# EAGLE schematic lupa-carrier (EAGLE 9.0.1)

## Sheet 1 of 5: berstak
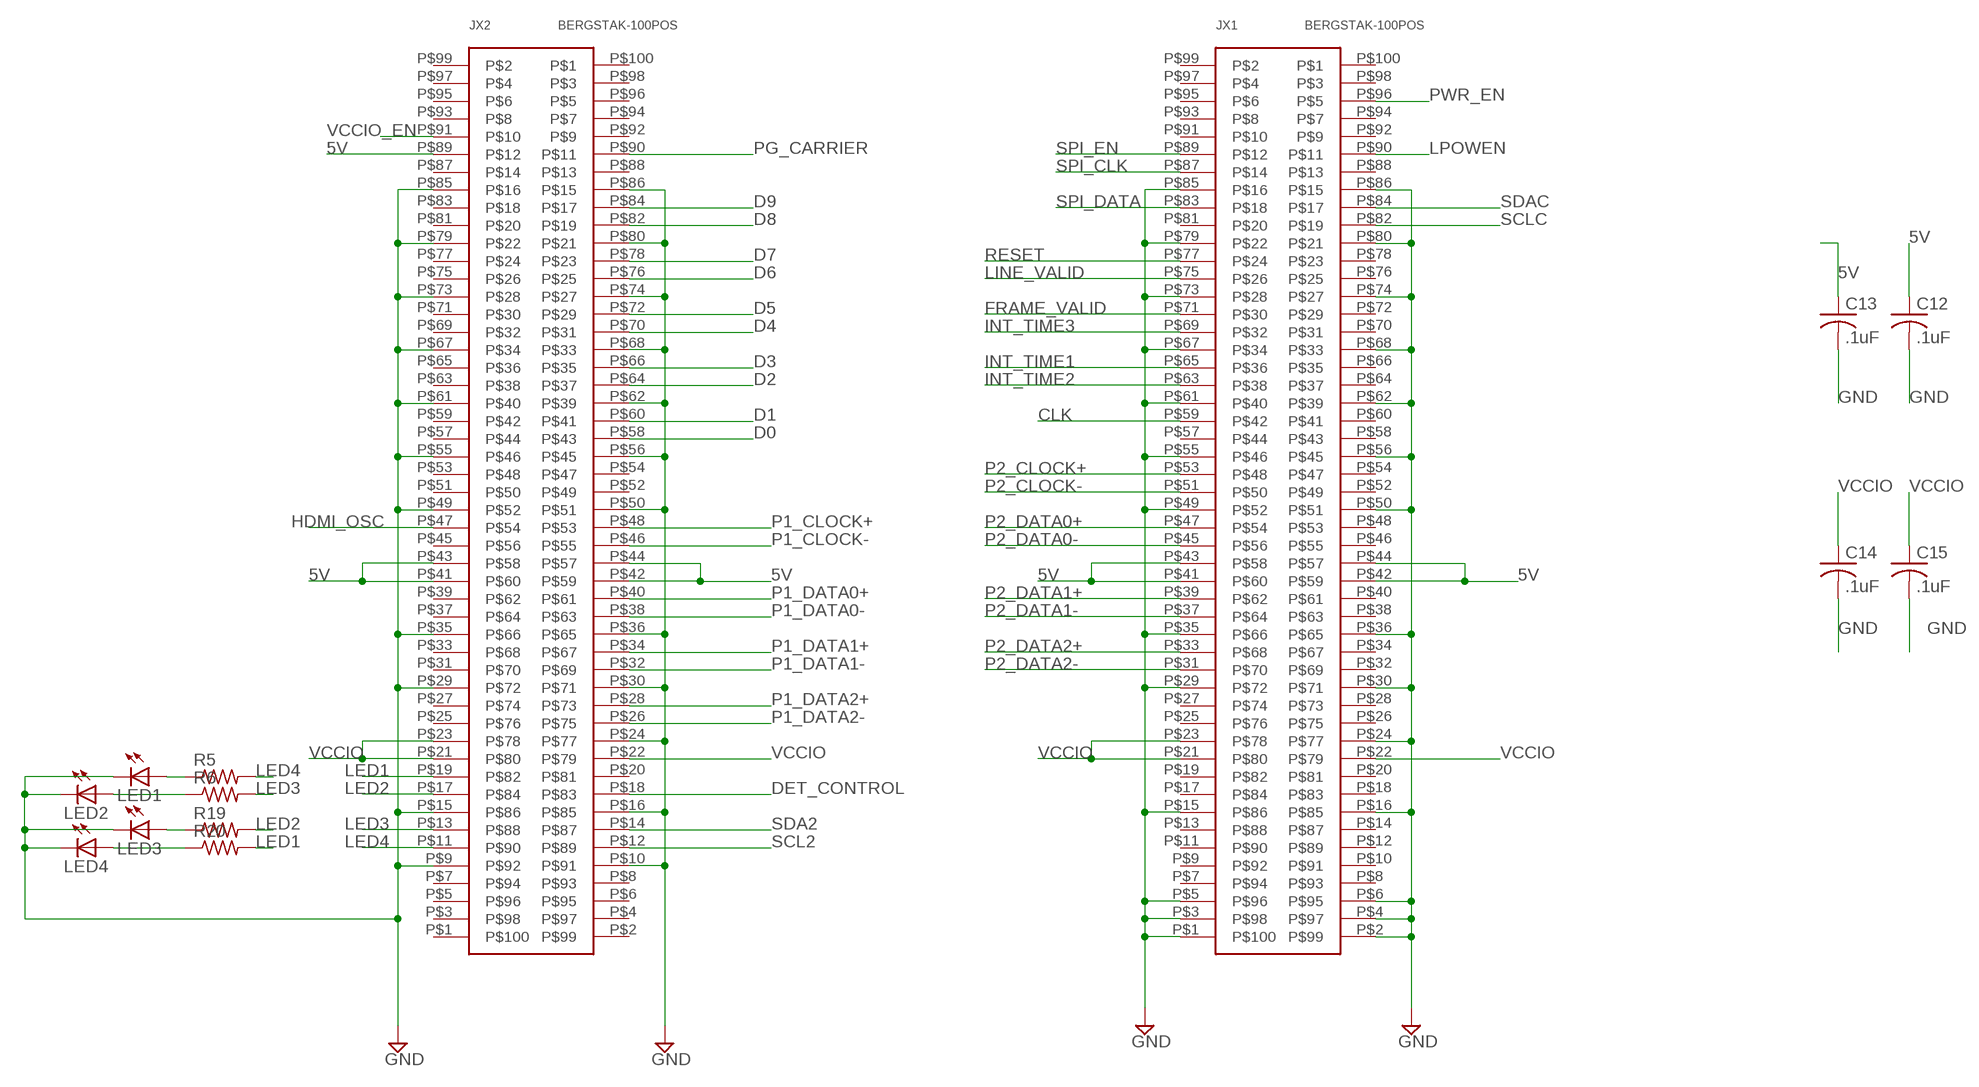
[diagram p0: schematic, sheet 1]

### Parts
C12  .1uF  C-USC0603  [C0603]
C13  .1uF  C-USC0603  [C0603]
C14  .1uF  C-USC0603  [C0603]
C15  .1uF  C-USC0603  [C0603]
JX1  BERGSTAK-100POS  [BERG100POS]
JX2  BERGSTAK-100POS  [BERG100POS]
LED1  LEDCHIPLED_0805  [CHIPLED_0805]
LED2  LEDCHIPLED_0805  [CHIPLED_0805]
LED3  LEDCHIPLED_0805  [CHIPLED_0805]
LED4  LEDCHIPLED_0805  [CHIPLED_0805]
R5  R-US_R0603  [R0603]
R6  R-US_R0603  [R0603]
R19  R-US_R0603  [R0603]
R20  R-US_R0603  [R0603]

### Nets
5V: C12.1 C13.1 JX1.P$41 JX1.P$42 JX1.P$43 JX1.P$44 JX2.P$41 JX2.P$42 JX2.P$43 JX2.P$44 JX2.P$89 ; also sheet 2,4,5
CLK: JX1.P$59 ; also sheet 3
D0: JX2.P$58 ; also sheet 3
D1: JX2.P$60 ; also sheet 3
D2: JX2.P$64 ; also sheet 3
D3: JX2.P$66 ; also sheet 3
D4: JX2.P$70 ; also sheet 3
D5: JX2.P$72 ; also sheet 3
D6: JX2.P$76 ; also sheet 3
D7: JX2.P$78 ; also sheet 3
D8: JX2.P$82 ; also sheet 3
D9: JX2.P$84 ; also sheet 3
DET_CONTROL: JX2.P$18 ; also sheet 5
FRAME_VALID: JX1.P$71 ; also sheet 3
GND: C12.2 C13.2 C14.2 C15.2 JX1.P$1 JX1.P$2 JX1.P$3 JX1.P$4 JX1.P$5 JX1.P$6 JX1.P$15 JX1.P$16 JX1.P$24 JX1.P$29 JX1.P$30 JX1.P$35 JX1.P$36 JX1.P$49 JX1.P$50 JX1.P$55 JX1.P$56 JX1.P$61 JX1.P$62 JX1.P$67 JX1.P$68 JX1.P$73 JX1.P$74 JX1.P$79 JX1.P$80 JX1.P$85 JX1.P$86 JX2.P$9 JX2.P$10 JX2.P$15 JX2.P$16 JX2.P$24 JX2.P$29 JX2.P$30 JX2.P$35 JX2.P$36 JX2.P$49 JX2.P$50 JX2.P$55 JX2.P$56 JX2.P$61 JX2.P$62 JX2.P$67 JX2.P$68 JX2.P$73 JX2.P$74 JX2.P$79 JX2.P$80 JX2.P$85 JX2.P$86 LED1.C LED2.C LED3.C LED4.C ; also sheet 2,3,4,5
HDMI_OSC: JX2.P$47 ; also sheet 5
INT_TIME1: JX1.P$65 ; also sheet 3
INT_TIME2: JX1.P$63 ; also sheet 3
INT_TIME3: JX1.P$69 ; also sheet 3
LED1: JX2.P$19 R20.2
LED2: JX2.P$17 R19.2
LED3: JX2.P$13 R6.2
LED4: JX2.P$11 R5.2
LINE_VALID: JX1.P$75 ; also sheet 3
LPOWEN: JX1.P$90 ; also sheet 4
N$3: LED1.A R5.1
N$13: LED2.A R6.1
N$15: LED3.A R19.1
N$16: LED4.A R20.1
P1_CLOCK+: JX2.P$48 ; also sheet 5
P1_CLOCK-: JX2.P$46 ; also sheet 5
P1_DATA0+: JX2.P$40 ; also sheet 5
P1_DATA0-: JX2.P$38 ; also sheet 5
P1_DATA1+: JX2.P$34 ; also sheet 5
P1_DATA1-: JX2.P$32 ; also sheet 5
P1_DATA2+: JX2.P$28 ; also sheet 5
P1_DATA2-: JX2.P$26 ; also sheet 5
P2_CLOCK+: JX1.P$53 ; also sheet 5
P2_CLOCK-: JX1.P$51 ; also sheet 5
P2_DATA0+: JX1.P$47 ; also sheet 5
P2_DATA0-: JX1.P$45 ; also sheet 5
P2_DATA1+: JX1.P$39 ; also sheet 5
P2_DATA1-: JX1.P$37 ; also sheet 5
P2_DATA2+: JX1.P$33 ; also sheet 5
P2_DATA2-: JX1.P$31 ; also sheet 5
PG_CARRIER: JX2.P$90
PWR_EN: JX1.P$96 ; also sheet 2
RESET: JX1.P$77 ; also sheet 3
SCL2: JX2.P$12 ; also sheet 5
SCLC: JX1.P$82 ; also sheet 5
SDA2: JX2.P$14 ; also sheet 5
SDAC: JX1.P$84 ; also sheet 5
SPI_CLK: JX1.P$87 ; also sheet 3
SPI_DATA: JX1.P$83 ; also sheet 3
SPI_EN: JX1.P$89 ; also sheet 3
VCCIO: C14.1 C15.1 JX1.P$21 JX1.P$22 JX1.P$23 JX2.P$21 JX2.P$22 JX2.P$23 ; also sheet 2,3,5
VCCIO_EN: JX2.P$91 ; also sheet 2
Unconnected: JX1.P$7 JX1.P$8 JX1.P$9 JX1.P$10 JX1.P$11 JX1.P$12 JX1.P$13 JX1.P$14 JX1.P$17 JX1.P$18 JX1.P$19 JX1.P$20 JX1.P$25 JX1.P$26 JX1.P$27 JX1.P$28 JX1.P$32 JX1.P$34 JX1.P$38 JX1.P$40 JX1.P$46 JX1.P$48 JX1.P$52 JX1.P$54 JX1.P$57 JX1.P$58 JX1.P$60 JX1.P$64 JX1.P$66 JX1.P$70 JX1.P$72 JX1.P$76 JX1.P$78 JX1.P$81 JX1.P$88 JX1.P$91 JX1.P$92 JX1.P$93 JX1.P$94 JX1.P$95 JX1.P$97 JX1.P$98 JX1.P$99 JX1.P$100 JX2.P$1 JX2.P$2 JX2.P$3 JX2.P$4 JX2.P$5 JX2.P$6 JX2.P$7 JX2.P$8 JX2.P$20 JX2.P$25 JX2.P$27 JX2.P$31 JX2.P$33 JX2.P$37 JX2.P$39 JX2.P$45 JX2.P$51 JX2.P$52 JX2.P$53 JX2.P$54 JX2.P$57 JX2.P$59 JX2.P$63 JX2.P$65 JX2.P$69 JX2.P$71 JX2.P$75 JX2.P$77 JX2.P$81 JX2.P$83 JX2.P$87 JX2.P$88 JX2.P$92 JX2.P$93 JX2.P$94 JX2.P$95 JX2.P$96 JX2.P$97 JX2.P$98 JX2.P$99 JX2.P$100

## Sheet 2 of 5: carrier power
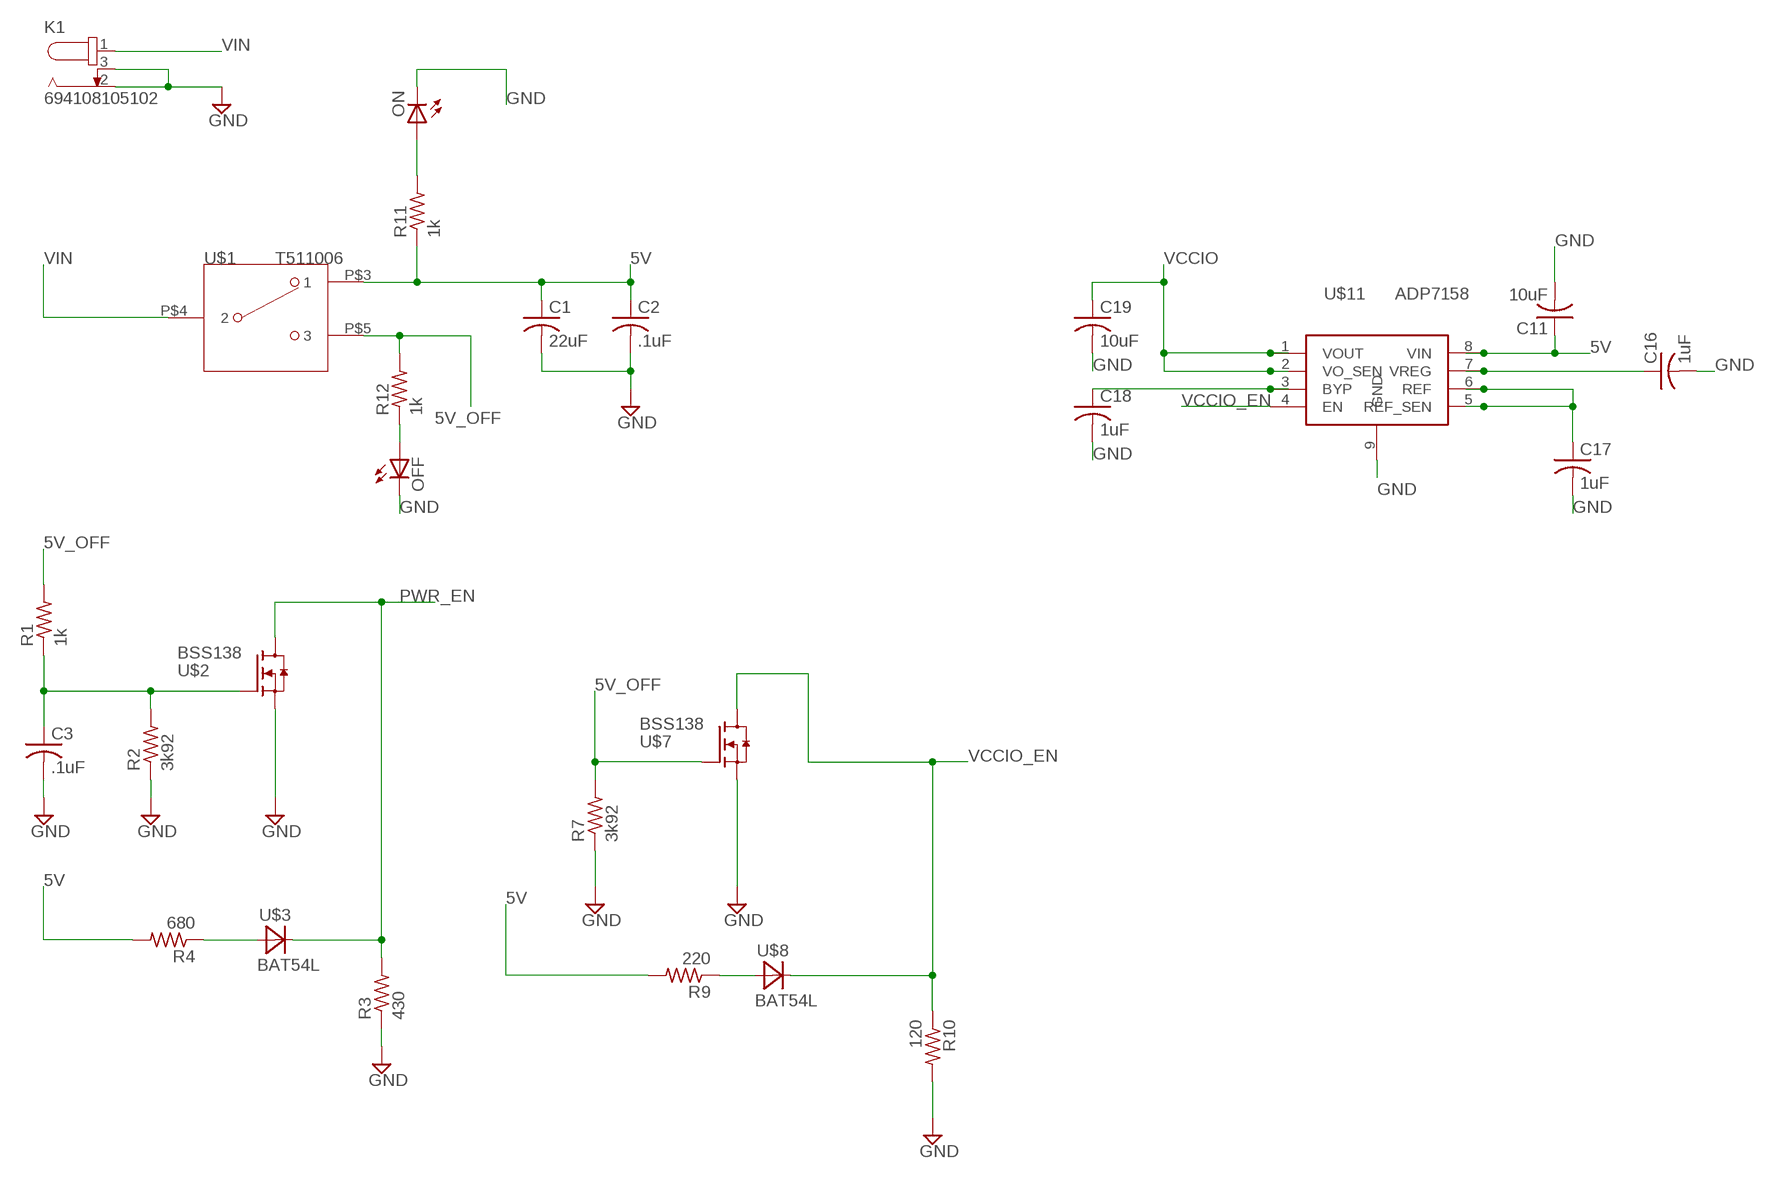
[diagram p1: schematic, sheet 2]

### Parts
C1  22uF  C-USC1206  [C1206]
C2  .1uF  C-USC0603  [C0603]
C3  .1uF  C-USC0603  [C0603]
C11  10uF  C-USC0603  [C0603]
C16  1uF  C-USC0603  [C0603]
C17  1uF  C-USC0603  [C0603]
C18  1uF  C-USC0603  [C0603]
C19  10uF  C-USC0603  [C0603]
K1  694108105102  [694108105102]
OFF  LEDCHIPLED_0805  [CHIPLED_0805]
ON  LEDCHIPLED_0805  [CHIPLED_0805]
R1  1k  R-US_R0603  [R0603]
R2  3k92  R-US_R0603  [R0603]
R3  430  R-US_R0603  [R0603]
R4  680  R-US_R0603  [R0603]
R7  3k92  R-US_R0603  [R0603]
R9  220  R-US_R0603  [R0603]
R10  120  R-US_R0603  [R0603]
R11  1k  R-US_R0603  [R0603]
R12  1k  R-US_R0603  [R0603]
U$1  T511006  [SPDT]
U$2  BSS138  [SOT23]
U$3  BAT54L  [SOT23]
U$7  BSS138  [SOT23]
U$8  BAT54L  [SOT23]
U$11  ADP7158  [SO08]

### Nets
5V: C1.1 C2.1 C11.1 R4.2 R9.2 R11.1 U$1.P$3 U$11.8(VIN) ; also sheet 1,4,5
5V_OFF: R1.2 R7.2 R12.2 U$1.P$5 U$7.1(G)
GND: C1.2 C2.2 C3.2 C11.2 C16.2 C17.2 C18.2 C19.2 K1.2 K1.3 OFF.C ON.C R2.1 R3.1 R7.1 R10.2 U$2.2(S) U$7.2(S) U$11.9(GND) ; also sheet 1,3,4,5
N$1: C3.1 R1.1 R2.2 U$2.1(G)
N$4: R4.1 U$3.1(A)
N$5: ON.A R11.2
N$8: R9.1 U$8.1(A)
N$10: C16.1 U$11.7(VREG)
N$11: C17.1 U$11.5(REF_SEN) U$11.6(REF)
N$12: C18.1 U$11.3(BYP)
N$24: OFF.A R12.1
PWR_EN: R3.2 U$2.3(D) U$3.3(C) ; also sheet 1
VCCIO: C19.1 U$11.1(VOUT) U$11.2(VO_SEN) ; also sheet 1,3,5
VCCIO_EN: R10.1 U$7.3(D) U$8.3(C) U$11.4(EN) ; also sheet 1
VIN: K1.1 U$1.P$4

## Sheet 3 of 5: lupa300
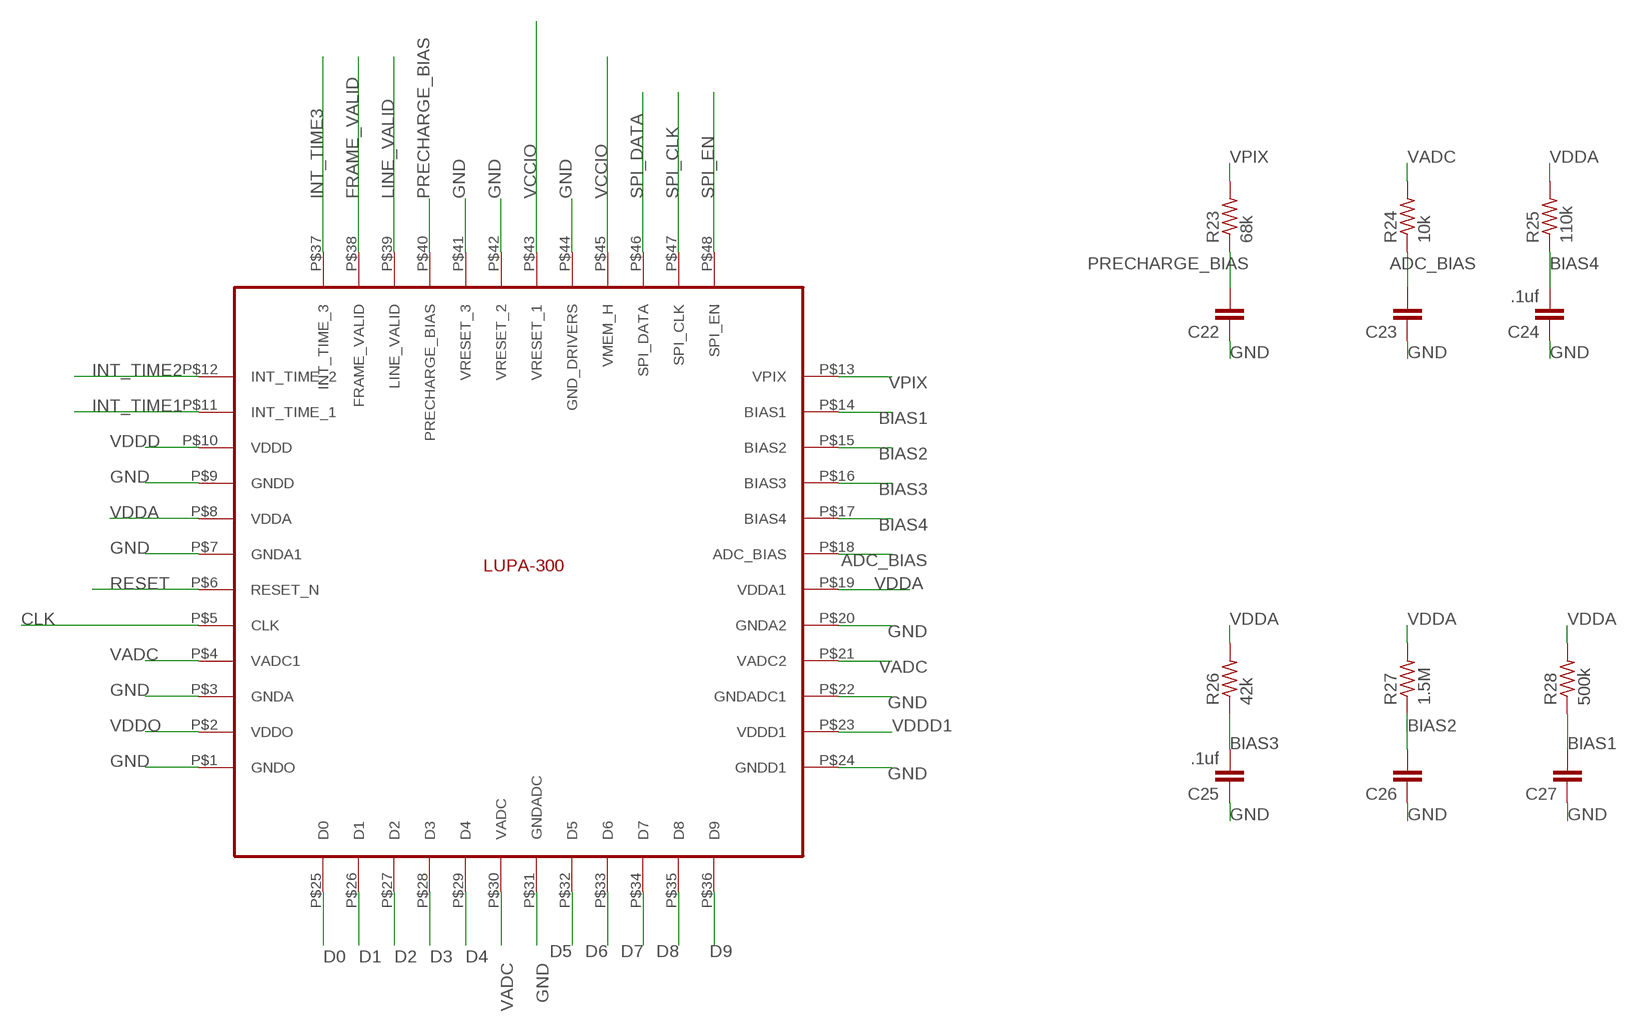
[diagram p2: schematic, sheet 3]

### Parts
C22  C-EUC0603  [C0603]
C23  C-EUC0603  [C0603]
C24  .1uf  C-EUC0603  [C0603]
C25  .1uf  C-EUC0603  [C0603]
C26  C-EUC0603  [C0603]
C27  C-EUC0603  [C0603]
R23  68k  R-US_R0603  [R0603]
R24  10k  R-US_R0603  [R0603]
R25  110k  R-US_R0603  [R0603]
R26  42k  R-US_R0603  [R0603]
R27  1.5M  R-US_R0603  [R0603]
R28  500k  R-US_R0603  [R0603]
U$4  LUPA300  [LUPA300]

### Nets
ADC_BIAS: C23.2 R24.1 U$4.P$18(ADC_BIAS)
BIAS1: C27.2 R28.1 U$4.P$14(BIAS1)
BIAS2: C26.2 R27.1 U$4.P$15(BIAS2)
BIAS3: C25.2 R26.1 U$4.P$16(BIAS3)
BIAS4: C24.2 R25.1 U$4.P$17(BIAS4)
CLK: U$4.P$5(CLK) ; also sheet 1
D0: U$4.P$25(D0) ; also sheet 1
D1: U$4.P$26(D1) ; also sheet 1
D2: U$4.P$27(D2) ; also sheet 1
D3: U$4.P$28(D3) ; also sheet 1
D4: U$4.P$29(D4) ; also sheet 1
D5: U$4.P$32(D5) ; also sheet 1
D6: U$4.P$33(D6) ; also sheet 1
D7: U$4.P$34(D7) ; also sheet 1
D8: U$4.P$35(D8) ; also sheet 1
D9: U$4.P$36(D9) ; also sheet 1
FRAME_VALID: U$4.P$38(FRAME_VALID) ; also sheet 1
GND: C22.1 C23.1 C24.1 C25.1 C26.1 C27.1 U$4.P$1(GNDO) U$4.P$3(GNDA) U$4.P$7(GNDA1) U$4.P$9(GNDD) U$4.P$20(GNDA2) U$4.P$22(GNDADC1) U$4.P$24(GNDD1) U$4.P$31(GNDADC) U$4.P$41(VRESET_3) U$4.P$42(VRESET_2) U$4.P$44(GND_DRIVERS) ; also sheet 1,2,4,5
INT_TIME1: U$4.P$11(INT_TIME_1) ; also sheet 1
INT_TIME2: U$4.P$12(INT_TIME_2) ; also sheet 1
INT_TIME3: U$4.P$37(INT_TIME_3) ; also sheet 1
LINE_VALID: U$4.P$39(LINE_VALID) ; also sheet 1
PRECHARGE_BIAS: C22.2 R23.1 U$4.P$40(PRECHARGE_BIAS)
RESET: U$4.P$6(RESET_N) ; also sheet 1
SPI_CLK: U$4.P$47(SPI_CLK) ; also sheet 1
SPI_DATA: U$4.P$46(SPI_DATA) ; also sheet 1
SPI_EN: U$4.P$48(SPI_EN) ; also sheet 1
VADC: R24.2 U$4.P$4(VADC1) U$4.P$21(VADC2) U$4.P$30(VADC) ; also sheet 4
VCCIO: U$4.P$43(VRESET_1) U$4.P$45(VMEM_H) ; also sheet 1,2,5
VDDA: R25.2 R26.2 R27.2 R28.2 U$4.P$8(VDDA) U$4.P$19(VDDA1) ; also sheet 4
VDDD: U$4.P$10(VDDD) ; also sheet 4
VDDD1: U$4.P$23(VDDD1) ; also sheet 4
VDDO: U$4.P$2(VDDO) ; also sheet 4
VPIX: R23.2 U$4.P$13(VPIX) ; also sheet 4

## Sheet 4 of 5: lupa power
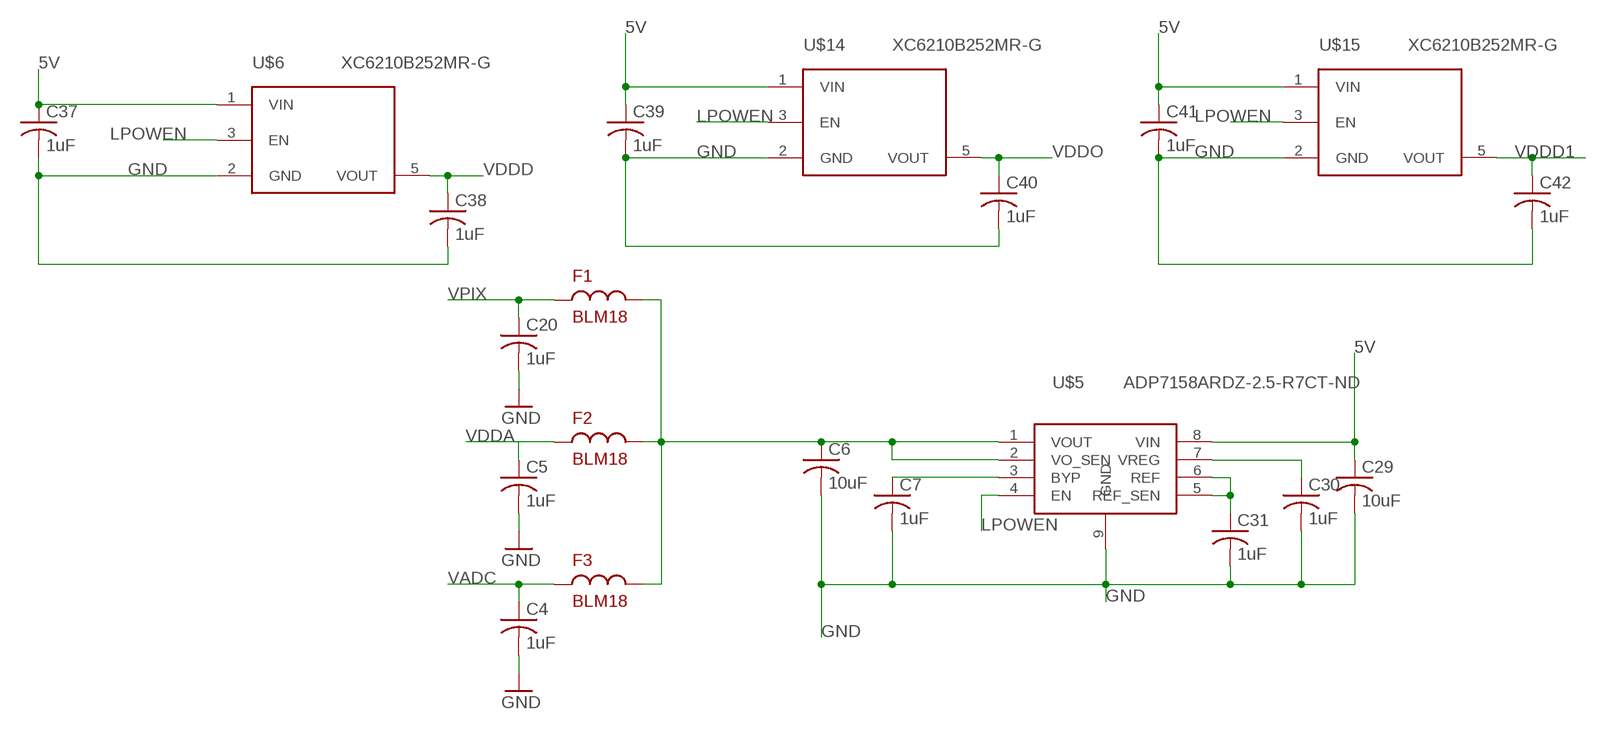
[diagram p3: schematic, sheet 4]

### Parts
C4  1uF  C-USC0603  [C0603]
C5  1uF  C-USC0603  [C0603]
C6  10uF  C-USC0603  [C0603]
C7  1uF  C-USC0603  [C0603]
C20  1uF  C-USC0603  [C0603]
C29  10uF  C-USC0603  [C0603]
C30  1uF  C-USC0603  [C0603]
C31  1uF  C-USC0603  [C0603]
C37  1uF  C-USC0603  [C0603]
C38  1uF  C-USC0603  [C0603]
C39  1uF  C-USC0603  [C0603]
C40  1uF  C-USC0603  [C0603]
C41  1uF  C-USC0603  [C0603]
C42  1uF  C-USC0603  [C0603]
F1  BLM18  [C0603K]
F2  BLM18  [C0603K]
F3  BLM18  [C0603K]
U$5  ADP7158ARDZ-2.5-R7CT-ND  [SO08]
U$6  XC6210B252MR-G  [SOT25]
U$14  XC6210B252MR-G  [SOT25]
U$15  XC6210B252MR-G  [SOT25]

### Nets
5V: C29.1 C37.1 C39.1 C41.1 U$5.8(VIN) U$6.1(VIN) U$14.1(VIN) U$15.1(VIN) ; also sheet 1,2,5
GND: C4.2 C5.2 C6.2 C7.2 C20.2 C29.2 C30.2 C31.2 C37.2 C38.2 C39.2 C40.2 C41.2 C42.2 U$5.9(GND) U$6.2(GND) U$14.2(GND) U$15.2(GND) ; also sheet 1,2,3,5
LPOWEN: U$5.4(EN) U$6.3(EN) U$14.3(EN) U$15.3(EN) ; also sheet 1
N$2: C6.1 F1.2 F2.2 F3.2 U$5.1(VOUT) U$5.2(VO_SEN)
N$14: C7.1 U$5.3(BYP)
N$22: C30.1 U$5.7(VREG)
N$23: C31.1 U$5.5(REF_SEN) U$5.6(REF)
VADC: C4.1 F3.1 ; also sheet 3
VDDA: C5.1 F2.1 ; also sheet 3
VDDD: C38.1 U$6.5(VOUT) ; also sheet 3
VDDD1: C42.1 U$15.5(VOUT) ; also sheet 3
VDDO: C40.1 U$14.5(VOUT) ; also sheet 3
VPIX: C20.1 F1.1 ; also sheet 3

## Sheet 5 of 5: HDMI connectors
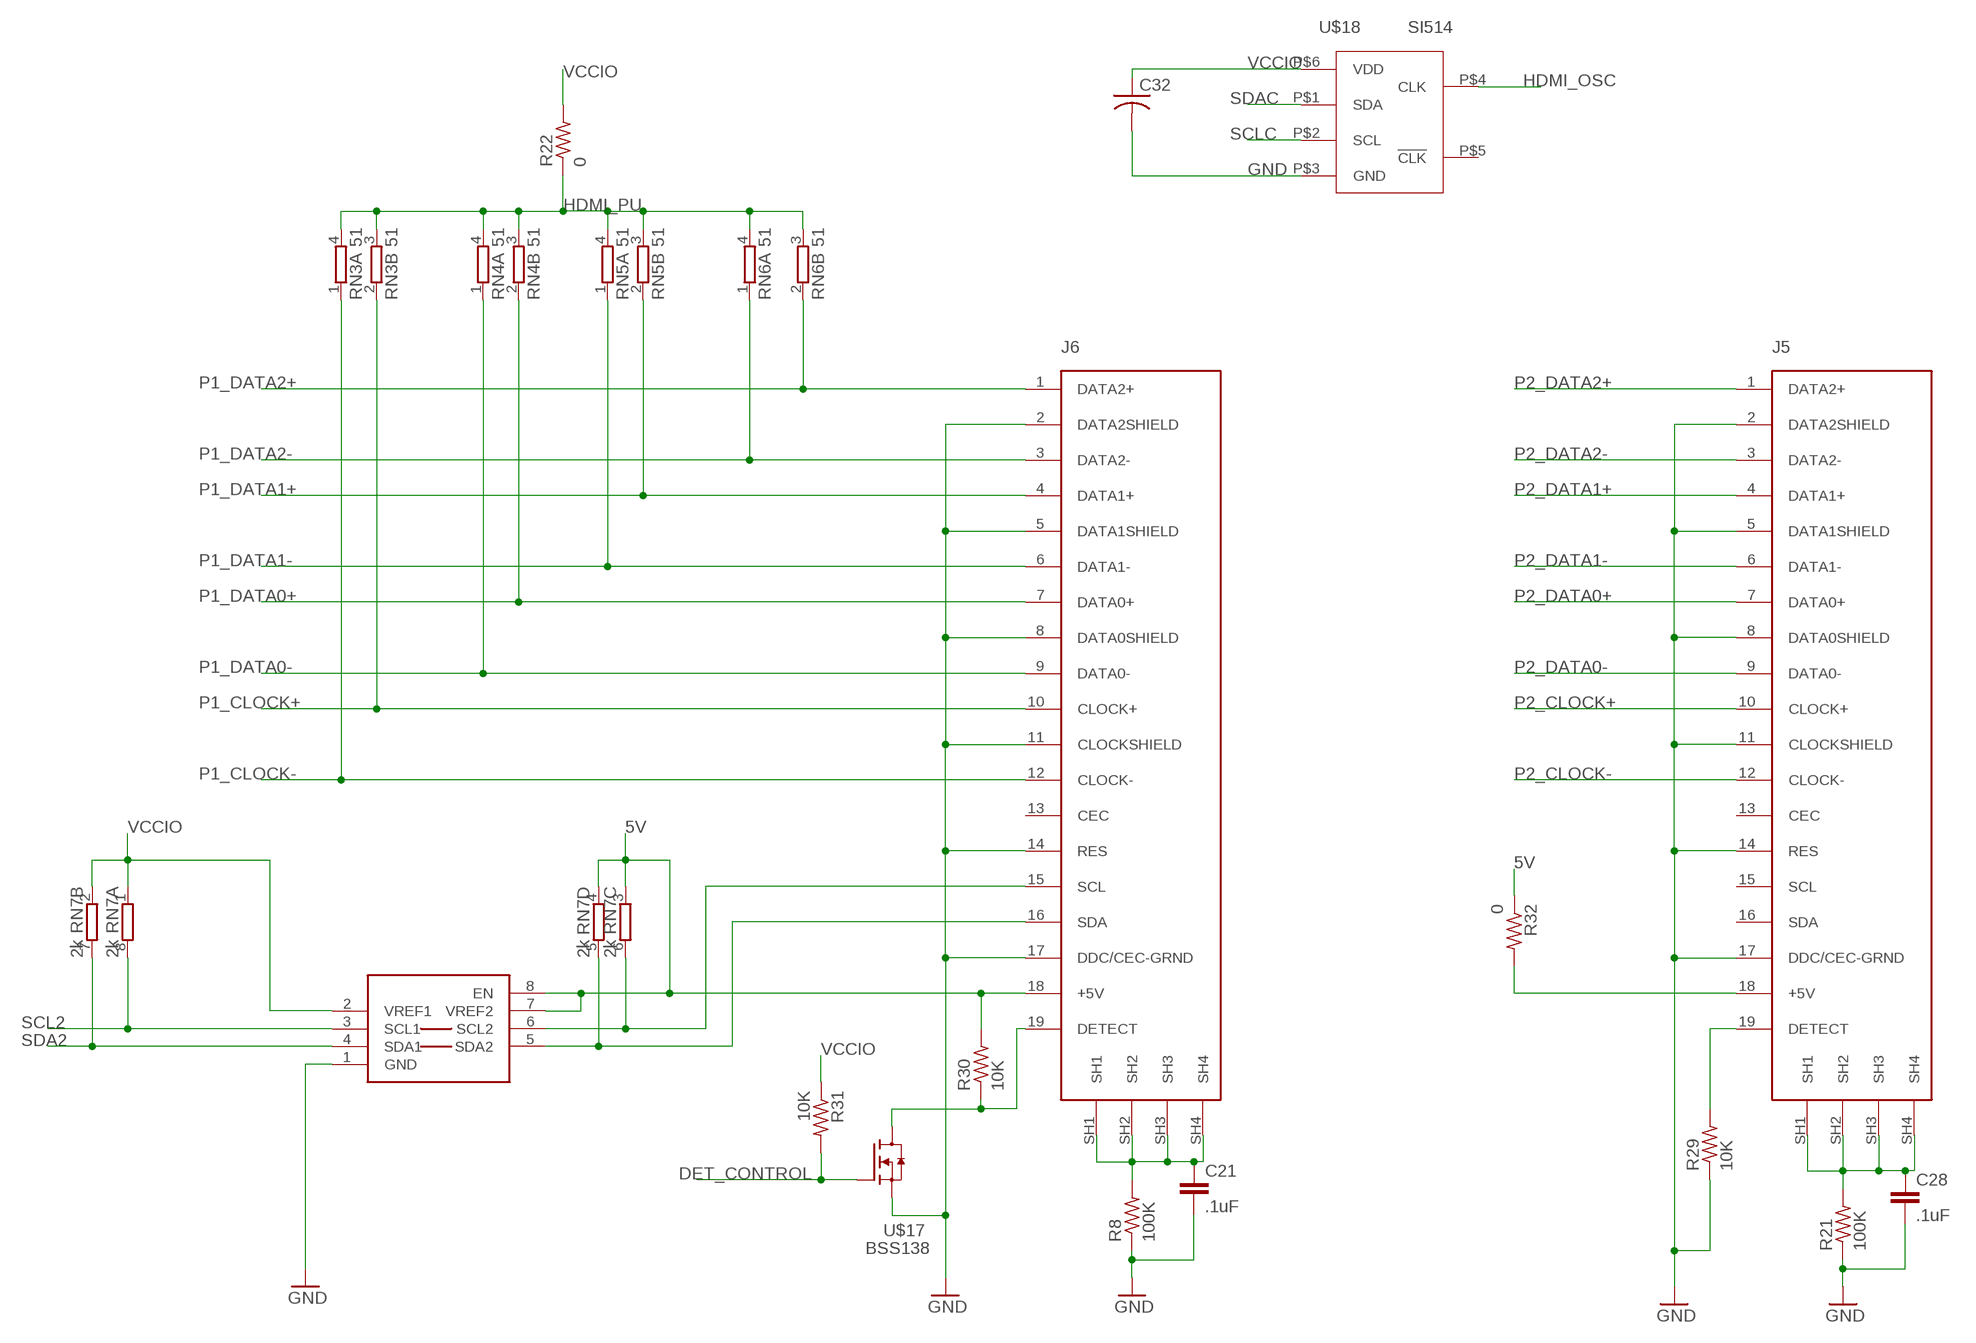
[diagram p4: schematic, sheet 5]

### Parts
C21  .1uF  C-EUC0603K  [C0603K]
C28  .1uF  C-EUC0603K  [C0603K]
C32  C-USC0603  [C0603]
J5  HDMI-TYPE-A-RECEPTICALFCI10029449  [FCI-HDMI-TYPE-A-RECEPT]
J6  HDMI-TYPE-A-RECEPTICALFCI10029449  [FCI-HDMI-TYPE-A-RECEPT]
PCA9306  PCA9306  [PSOP-8]
R8  100K  R-US_R0603  [R0603]
R21  100K  R-US_R0603  [R0603]
R22  0  R-US_R0603  [R0603]
R29  10K  R-US_R0603  [R0603]
R30  10K  R-US_R0603  [R0603]
R31  10K  R-US_R0603  [R0603]
R32  0  R-US_R0603  [R0603]
RN3  51  2R-NEXB34V  [EXB34V]
RN4  51  2R-NEXB34V  [EXB34V]
RN5  51  2R-NEXB34V  [EXB34V]
RN6  51  2R-NEXB34V  [EXB34V]
RN7  2k  4R-N0603-ARV  [0603-ARV]
U$17  BSS138  [SOT23]
U$18  SI514  [XTAL-6PIN]

### Nets
5V: J6.18(+5V) PCA9306.7(VREF2) PCA9306.8(EN) R30.2 R32.1 RN7.3 RN7.4 ; also sheet 1,2,4
DET_CONTROL: R31.2 U$17.1(G) ; also sheet 1
GND: C21.2 C28.2 C32.2 J5.2(DATA2SHIELD) J5.5(DATA1SHIELD) J5.8(DATA0SHIELD) J5.11(CLOCKSHIELD) J5.14(RES) J5.17(DDC/CEC-GRND) J6.2(DATA2SHIELD) J6.5(DATA1SHIELD) J6.8(DATA0SHIELD) J6.11(CLOCKSHIELD) J6.14(RES) J6.17(DDC/CEC-GRND) PCA9306.1(GND) R8.1 R21.1 R29.1 U$17.2(S) U$18.P$3(GND) ; also sheet 1,2,3,4
HDMI_OSC: U$18.P$4(CLK) ; also sheet 1
HDMI_PU: R22.1 RN3.3 RN3.4 RN4.3 RN4.4 RN5.3 RN5.4 RN6.3 RN6.4
N$6: C28.1 J5.SH1 J5.SH2 J5.SH3 J5.SH4 R21.2
N$17: J5.19(DETECT) R29.2
N$18: J6.19(DETECT) R30.1 U$17.3(D)
N$19: J6.16(SDA) PCA9306.5(SDA2) RN7.5
N$20: J6.15(SCL) PCA9306.6(SCL2) RN7.6
N$21: J5.18(+5V) R32.2
N$34: C21.1 J6.SH1 J6.SH2 J6.SH3 J6.SH4 R8.2
P1_CLOCK+: J6.10(CLOCK+) RN3.2 ; also sheet 1
P1_CLOCK-: J6.12(CLOCK-) RN3.1 ; also sheet 1
P1_DATA0+: J6.7(DATA0+) RN4.2 ; also sheet 1
P1_DATA0-: J6.9(DATA0-) RN4.1 ; also sheet 1
P1_DATA1+: J6.4(DATA1+) RN5.2 ; also sheet 1
P1_DATA1-: J6.6(DATA1-) RN5.1 ; also sheet 1
P1_DATA2+: J6.1(DATA2+) RN6.2 ; also sheet 1
P1_DATA2-: J6.3(DATA2-) RN6.1 ; also sheet 1
P2_CLOCK+: J5.10(CLOCK+) ; also sheet 1
P2_CLOCK-: J5.12(CLOCK-) ; also sheet 1
P2_DATA0+: J5.7(DATA0+) ; also sheet 1
P2_DATA0-: J5.9(DATA0-) ; also sheet 1
P2_DATA1+: J5.4(DATA1+) ; also sheet 1
P2_DATA1-: J5.6(DATA1-) ; also sheet 1
P2_DATA2+: J5.1(DATA2+) ; also sheet 1
P2_DATA2-: J5.3(DATA2-) ; also sheet 1
SCL2: PCA9306.3(SCL1) RN7.8 ; also sheet 1
SCLC: U$18.P$2(SCL) ; also sheet 1
SDA2: PCA9306.4(SDA1) RN7.7 ; also sheet 1
SDAC: U$18.P$1(SDA) ; also sheet 1
VCCIO: C32.1 PCA9306.2(VREF1) R22.2 R31.1 RN7.1 RN7.2 U$18.P$6(VDD) ; also sheet 1,2,3
Unconnected: J5.13(CEC) J5.15(SCL) J5.16(SDA) J6.13(CEC) U$18.P$5(!CLK)

## Library data of the parts
C1-C7 C11-C20 C29-C32 C37-C42 = rcl:C-US: CAPACITOR, American symbol; SPICEPREFIX: C
C21 C28 = rcl:C-EU: CAPACITOR, European symbol
C22-C27 = rcl:C-EU: CAPACITOR, European symbol; SPICEPREFIX: C
F1-F3 = lupa300-components:BLM18: FERRITE BEAD 120 OHM 0603 1LN
J5 J6 = saanlima:HDMI-TYPE-A-RECEPTICAL
JX1 JX2 = lupa300-components:BERGSTAK-100POS
K1 = Wurth_Elektronik_Electromechanic_DC_Power_Jack_Connectors_rev15c:694108105102: WR-DC_DC Power Jack_Right Angled_SMT Center Pin Ø2.5_Plug ID Ø2.55_Plug OD Ø5.5_with Peg ;=>Code : Con_WR-DC_SMT_694106105102_694108105102 <http://katalog.we-online.de/media/images/eican/Con_WR-DC_SMT_694106105102_pf2.jpg> Details see: http://katalog.we-online.de/em/datasheet/6941xx105102.pdf Created 2014-10-08, Karrer Zheng 2014 (C) Wurth Elektronik
LED1-LED4 = led:LED: LED
OFF ON = adafruit:LED: LED
PCA9306 = saanlima:PCA9306
R1-R4 R7 R9-R12 R22-R28 = rcl:R-US_: RESISTOR, American symbol; SPICEPREFIX: R
R5 R6 R19 R20 = resistor:R-US_: RESISTOR, American symbol
R8 R21 R29-R32 = rcl:R-US_: RESISTOR, American symbol
RN3-RN6 = resistor-dil:2R-N: Array Chip Resistor Source: Panasonic; OC_FARNELL: unknown; OC_NEWARK: unknown
RN7 = resistor-dil:4R-N: Array Chip Resistor Source: RS Component / Phycomp; OC_FARNELL: unknown; OC_NEWARK: unknown
U$1 = lupa300-components:T511006: Slide Switch SPDT Through Hole, Right Angle
U$2 U$7 U$17 = lupa300-components:BSS138: N-Channel 50V 220mA (Ta) 360mW (Ta) Surface Mount SOT-23-3
U$3 U$8 = lupa300-components:BAT54L: Diode Schottky 30V 200mA (DC) Surface Mount SOT-23-3 (TO-236)
U$4 = andon:LUPA300
U$5 = lupa300-components:ADP7158ARDZ-2.5-R7CT-ND: Linear Voltage Regulator IC Positive Fixed 1 Output 2.5V 2A 8-SOIC-EP
U$6 U$14 U$15 = lupa300-components:XC6210B252MR-G: Linear Voltage Regulator IC Positive Fixed 1 Output 2.5V 700mA SOT-25
U$11 = lupa300-components:ADP7158: Linear Voltage Regulator IC Positive Fixed 1 Output 3.3V 2A 8-SOIC-EP
U$18 = lupa300-components:SI514